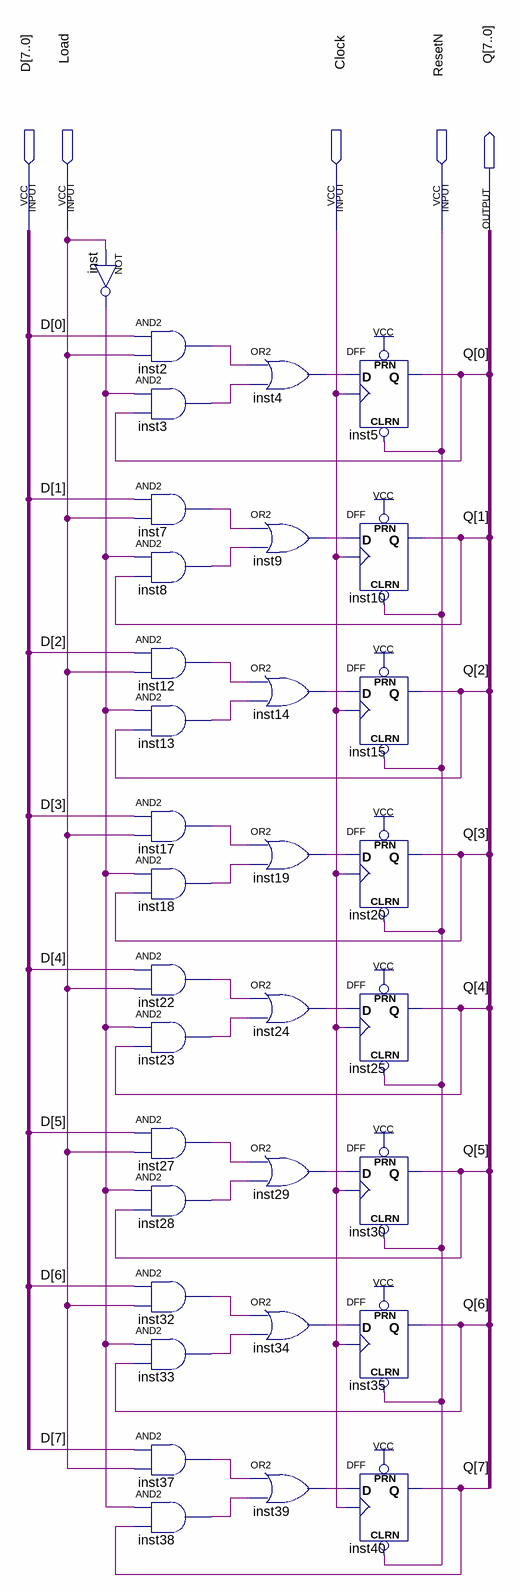
[diagram p0: schematic sheet]
// Quartus schematic GenReg8Bit.bdf as structural Verilog: 33 symbols, 5 pins
module GenReg8Bit (
  input  [7:0] D,
  input  Load,
  input  Clock,
  input  ResetN,
  output [7:0] Q
);

  wire inst2_out, inst3_out, inst4_out, inst7_out, inst8_out, inst9_out, inst12_out, inst13_out, inst14_out,
       inst17_out, inst18_out, inst19_out, inst22_out, inst23_out, inst24_out, inst27_out, inst28_out,
       inst29_out, inst32_out, inst33_out, inst34_out, inst37_out, inst38_out, inst39_out, inst_out;

  not inst (inst_out, Load);
  and inst2 (inst2_out, D[0], Load);
  and inst3 (inst3_out, inst_out, Q[0]);
  and inst7 (inst7_out, D[1], Load);
  and inst8 (inst8_out, inst_out, Q[1]);
  and inst12 (inst12_out, D[2], Load);
  and inst13 (inst13_out, inst_out, Q[2]);
  and inst17 (inst17_out, D[3], Load);
  and inst18 (inst18_out, inst_out, Q[3]);
  and inst22 (inst22_out, D[4], Load);
  and inst23 (inst23_out, inst_out, Q[4]);
  and inst27 (inst27_out, D[5], Load);
  and inst28 (inst28_out, inst_out, Q[5]);
  and inst32 (inst32_out, D[6], Load);
  and inst33 (inst33_out, inst_out, Q[6]);
  and inst37 (inst37_out, D[7], Load);
  and inst38 (inst38_out, inst_out, Q[7]);
  or inst4 (inst4_out, inst2_out, inst3_out);
  or inst9 (inst9_out, inst7_out, inst8_out);
  or inst14 (inst14_out, inst12_out, inst13_out);
  or inst19 (inst19_out, inst17_out, inst18_out);
  or inst24 (inst24_out, inst22_out, inst23_out);
  or inst29 (inst29_out, inst27_out, inst28_out);
  or inst34 (inst34_out, inst32_out, inst33_out);
  or inst39 (inst39_out, inst37_out, inst38_out);
  DFF inst5 (.CLRN(ResetN), .CLK(Clock), .D(inst4_out), .PRN(1'b1), .Q(Q[0]));
  DFF inst10 (.CLRN(ResetN), .CLK(Clock), .D(inst9_out), .PRN(1'b1), .Q(Q[1]));
  DFF inst15 (.CLRN(ResetN), .CLK(Clock), .D(inst14_out), .PRN(1'b1), .Q(Q[2]));
  DFF inst20 (.CLRN(ResetN), .CLK(Clock), .D(inst19_out), .PRN(1'b1), .Q(Q[3]));
  DFF inst25 (.CLRN(ResetN), .CLK(Clock), .D(inst24_out), .PRN(1'b1), .Q(Q[4]));
  DFF inst30 (.CLRN(ResetN), .CLK(Clock), .D(inst29_out), .PRN(1'b1), .Q(Q[5]));
  DFF inst35 (.CLRN(ResetN), .CLK(Clock), .D(inst34_out), .PRN(1'b1), .Q(Q[6]));
  DFF inst40 (.CLRN(ResetN), .CLK(Clock), .D(inst39_out), .PRN(1'b1), .Q(Q[7]));
endmodule
